# Altium schematic sheet PIPTIK.SchDoc: PIPTIK STM32F103
size A2; DrawnBy: Sklyar Roman; Organization: github.com/S-LABc/PIPTIK; Address1: Russian Federation; Address2: Sergiev Posad; DocumentNumber: 1; Revision: 1.1; SheetNumber: 1; SheetTotal: 1
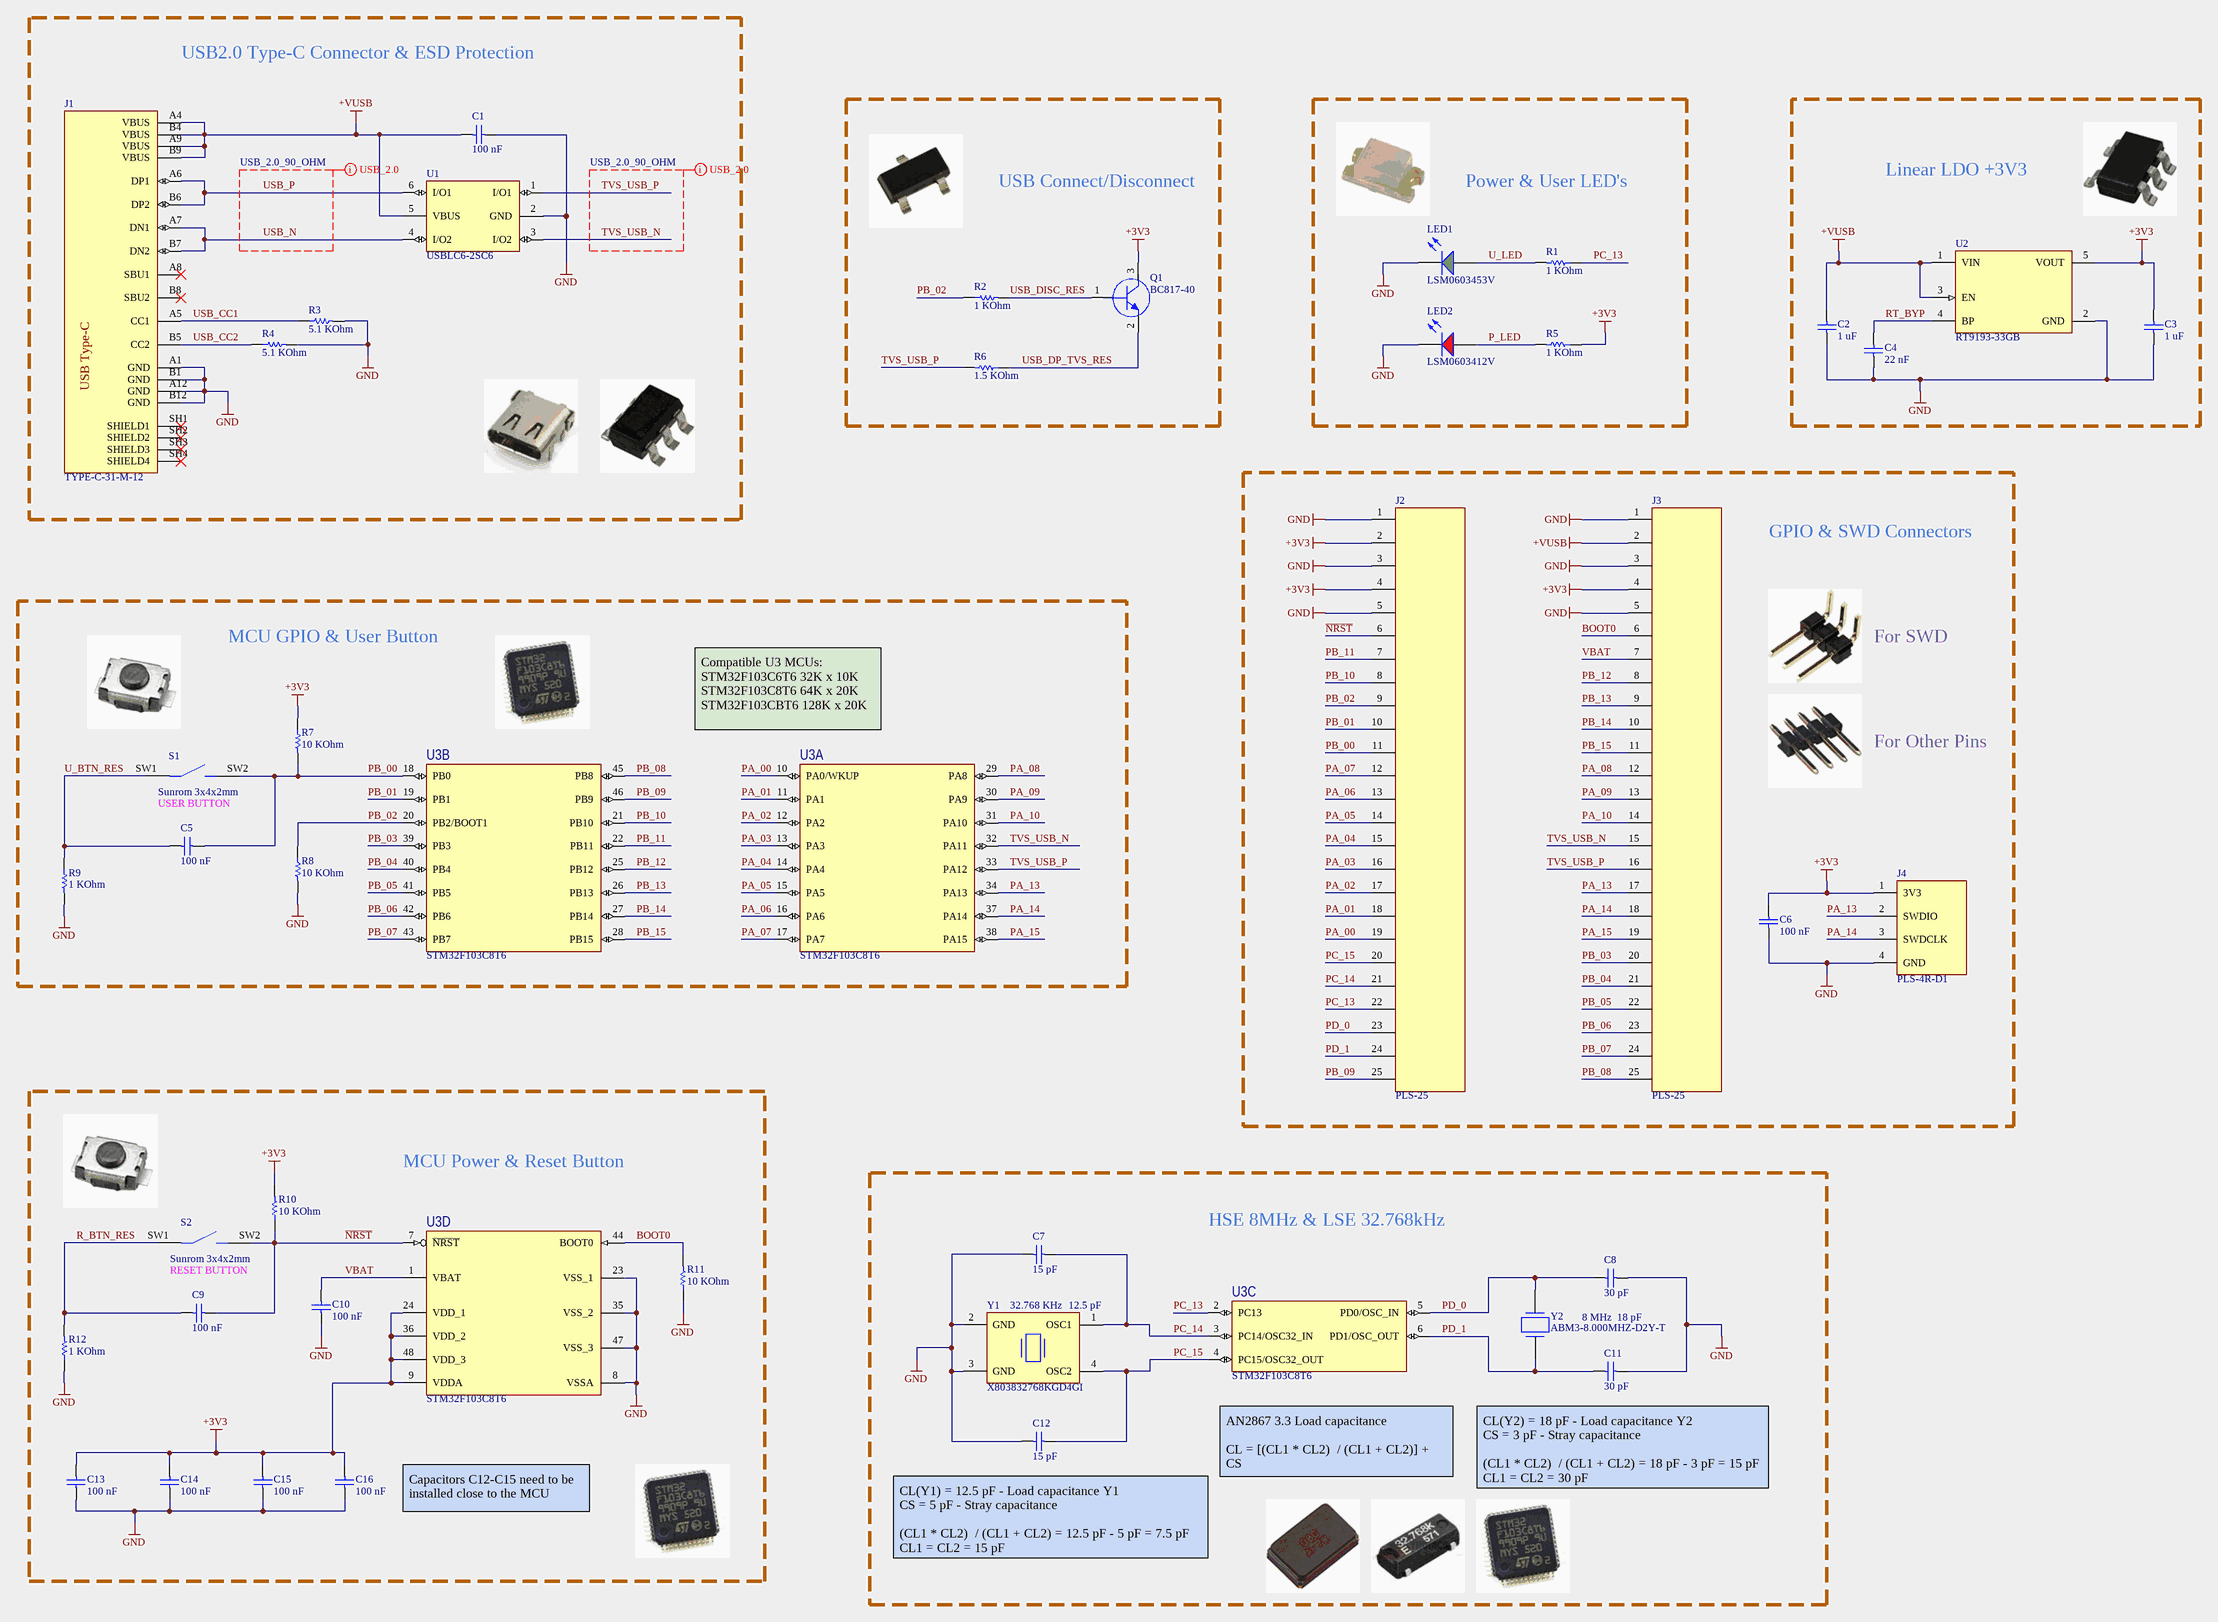
[diagram p0: PIPTIK.SchDoc]

## Parts
C1  Capacitance: 100 nF  [CAPC0603]  (hidden comment: CAP-100N)
C2  Capacitance: 1 uF  [CAPC0805]  (hidden comment: CAP-1U)
C3  Capacitance: 1 uF  [CAPC0805]  (hidden comment: CAP-1U)
C4  Capacitance: 22 nF  [CAPC0603]  (hidden comment: CAP-22N)
C5  Capacitance: 100 nF  [CAPC0603]  (hidden comment: CAP-100N)
C6  Capacitance: 100 nF  [CAPC0603]  (hidden comment: CAP-100N)
C7  Capacitance: 15 pF  [CAPC0603]  (hidden comment: CAP-15P)
C8  Capacitance: 30 pF  [CAPC0603]  (hidden comment: CAP-30P)
C9  Capacitance: 100 nF  [CAPC0603]  (hidden comment: CAP-100N)
C10  Capacitance: 100 nF  [CAPC0603]  (hidden comment: CAP-100N)
C11  Capacitance: 30 pF  [CAPC0603]  (hidden comment: CAP-30P)
C12  Capacitance: 15 pF  [CAPC0603]  (hidden comment: CAP-15P)
C13  Capacitance: 100 nF  [CAPC0603]  (hidden comment: CAP-100N)
C14  Capacitance: 100 nF  [CAPC0603]  (hidden comment: CAP-100N)
C15  Capacitance: 100 nF  [CAPC0603]  (hidden comment: CAP-100N)
C16  Capacitance: 100 nF  [CAPC0603]  (hidden comment: CAP-100N)
J1  TYPE-C-31-M-12  [TYPE-C-31-M-12]
J2  PLS-25  [PLS-25]
J3  PLS-25  [PLS-25]
J4  PLS-4RD  [PLS-4R-D1]  (value not drawn)
LED1  LSM0603453V  [LSM0603-Series]
LED2  LSM0603412V  [LSM0603-Series]
Q1  BC817-40  [SOT23-3-AnBon]
R1  Resistance: 1 KOhm  [RES0603]  (hidden comment: RES-1K)
R2  Resistance: 1 KOhm  [RES0603]  (hidden comment: RES-1K)
R3  Resistance: 5.1 KOhm  [RES0603]  (hidden comment: RES-5K1)
R4  Resistance: 5.1 KOhm  [RES0603]  (hidden comment: RES-5K1)
R5  Resistance: 1 KOhm  [RES0603]  (hidden comment: RES-1K)
R6  Resistance: 1.5 KOhm  [RES0603]  (hidden comment: RES-1K5)
R7  Resistance: 10 KOhm  [RES0603]  (hidden comment: RES-10K)
R8  Resistance: 10 KOhm  [RES0603]  (hidden comment: RES-10K)
R9  Resistance: 1 KOhm  [RES0603]  (hidden comment: RES-1K)
R10  Resistance: 10 KOhm  [RES0603]  (hidden comment: RES-10K)
R11  Resistance: 10 KOhm  [RES0603]  (hidden comment: RES-10K)
R12  Resistance: 1 KOhm  [RES0603]  (hidden comment: RES-1K)
S1  USER BUTTON  Model: Sunrom 3x4x2mm  [Tactile Switch SMD 3x4x2]
S2  RESET BUTTON  Model: Sunrom 3x4x2mm  [Tactile Switch SMD 3x4x2]
U1  USBLC6-2SC6  [SOT23-6L-STM]
U2  RT9193-33GB  [SOT-23-5-RICHTEK]
U3  STM32F103C8T6  [LQFP-48-STM32]  (parts A,B,C,D of 4)
Y1  Frequency: 32.768 KHz  LoadCapacitance: 12.5 pF  [YSX-306G-A]  (hidden comment: X803832768KGD4GI)
Y2  Frequency: 8 MHz  LoadCapacitance: 18 pF  [ABM3-2P]  (hidden comment: ABM3-8.000MHZ-D2Y-T)

## Blocks framed on the sheet
USB2.0 Type-C Connector & ESD Protection: C1 J1 R3 R4 U1
USB Connect/Disconnect: Q1 R2 R6
Power & User LED's: LED1 LED2 R1 R5
Linear LDO +3V3: C2-C4 U2
MCU GPIO & User Button: C5 R7-R9 S1 U3
MCU Power & Reset Button: C9 C10 C13-C16 R10-R12 S2 U3
HSE 8MHz & LSE 32.768kHz: C7 C8 C11 C12 U3 Y1 Y2

## Nets
+3V3: C3.2 C6.1 C13.2 C14.2 C15.2 C16.2 J2.2 J2.4 J3.4 J4.1(3V3) Q1.3(C) R5.1 R7.1 R10.2 U2.5(VOUT) U3.9(VDDA) U3.24(VDD_1) U3.36(VDD_2) U3.48(VDD_3)
+VUSB: C1.2 C2.2 J1.A4(VBUS) J1.A9(VBUS) J1.B4(VBUS) J1.B9(VBUS) J3.2 U1.5(VBUS) U2.1(VIN) U2.3(EN)
GND: C1.1 C2.1 C3.1 C4.1 C6.2 C7.1 C8.2 C10.1 C11.2 C12.1 C13.1 C14.1 C15.1 C16.1 J1.A1(GND) J1.A12(GND) J1.B1(GND) J1.B12(GND) J2.1 J2.3 J2.5 J3.1 J3.3 J3.5 J4.4(GND) LED1.1(K) LED2.1(K) R3.2 R4.2 R8.2 R9.2 R11.1 R12.1 U1.2(GND) U2.2(GND) U3.8(VSSA) U3.23(VSS_1) U3.35(VSS_2) U3.47(VSS_3) Y1.2(GND) Y1.3(GND)
BOOT0: J3.6 R11.2 U3.44(BOOT0)
~{NRST}: C9.1 J2.6 R10.1 S2.SW2 U3.7(~{NRST})
P_LED: LED2.2(A) R5.2
PA_00: J2.19 U3.10(PA0/WKUP)
PA_01: J2.18 U3.11(PA1)
PA_02: J2.17 U3.12(PA2)
PA_03: J2.16 U3.13(PA3)
PA_04: J2.15 U3.14(PA4)
PA_05: J2.14 U3.15(PA5)
PA_06: J2.13 U3.16(PA6)
PA_07: J2.12 U3.17(PA7)
PA_08: J3.12 U3.29(PA8)
PA_09: J3.13 U3.30(PA9)
PA_10: J3.14 U3.31(PA10)
PA_13: J3.17 J4.2(SWDIO) U3.34(PA13)
PA_14: J3.18 J4.3(SWDCLK) U3.37(PA14)
PA_15: J3.19 U3.38(PA15)
PB_00: C5.1 J2.11 R7.2 S1.SW2 U3.18(PB0)
PB_01: J2.10 U3.19(PB1)
PB_02: J2.9 R2.1 R8.1 U3.20(PB2/BOOT1)
PB_03: J3.20 U3.39(PB3)
PB_04: J3.21 U3.40(PB4)
PB_05: J3.22 U3.41(PB5)
PB_06: J3.23 U3.42(PB6)
PB_07: J3.24 U3.43(PB7)
PB_08: J3.25 U3.45(PB8)
PB_09: J2.25 U3.46(PB9)
PB_10: J2.8 U3.21(PB10)
PB_11: J2.7 U3.22(PB11)
PB_12: J3.8 U3.25(PB12)
PB_13: J3.9 U3.26(PB13)
PB_14: J3.10 U3.27(PB14)
PB_15: J3.11 U3.28(PB15)
PC_13: J2.22 R1.1 U3.2(PC13)
PC_14: C7.2 J2.21 U3.3(PC14/OSC32_IN) Y1.1(OSC1)
PC_15: C12.2 J2.20 U3.4(PC15/OSC32_OUT) Y1.4(OSC2)
PD_0: C8.1 J2.23 U3.5(PD0/OSC_IN) Y2.2(OSC2)
PD_1: C11.1 J2.24 U3.6(PD1/OSC_OUT) Y2.1(OSC1)
R_BTN_RES: C9.2 R12.2 S2.SW1
RT_BYP: C4.2 U2.4(BP)
TVS_USB_N: J3.15 U1.3(I/O2) U3.32(PA11)
TVS_USB_P: J3.16 R6.2 U1.1(I/O1) U3.33(PA12)
U_BTN_RES: C5.2 R9.1 S1.SW1
U_LED: LED1.2(A) R1.2
USB_CC1: J1.A5(CC1) R3.1
USB_CC2: J1.B5(CC2) R4.1
USB_DISC_RES: Q1.1(B) R2.2
USB_DP_TVS_RES: Q1.2(E) R6.1
USB_N: J1.A7(DN1) J1.B7(DN2) U1.4(I/O2)
USB_P: J1.A6(DP1) J1.B6(DP2) U1.6(I/O1)
VBAT: C10.2 J3.7 U3.1(VBAT)

Not connected (* = marked no-connect by the designer): J1 A8(SBU1)* B8(SBU2)* SH1(SHIELD1)* SH2(SHIELD2)* SH3(SHIELD3)* SH4(SHIELD4)*

## Layout directives
differential pair; net class USB2.0; differential pair class USB_2.0_90_OHM: TVS_USB_N, TVS_USB_P, USB_N, USB_P

## Notes on the sheet
- GPIO & SWD Connectors
- For SWD
- (near U3) Compatible U3 MCUs:
  STM32F103C6T6 32K x 10K
  STM32F103C8T6 64K x 20K
  STM32F103CBT6 128K x 20K
- For Other Pins
- (near U3) AN2867 3.3 Load capacitance
  CL = [(CL1 * CL2)  / (CL1 + CL2)] + CS
  (CL1 * CL2)  / (CL1 + CL2) = CL - CS
- Capacitors C12-C15 need to be installed close to the MCU
- (near C11) CL(Y2) = 18 pF - Load capacitance Y2
  CS = 3 pF - Stray capacitance
  (CL1 * CL2)  / (CL1 + CL2) = 18 pF - 3 pF = 15 pF
  CL1 = CL2 = 30 pF
- (near C12) CL(Y1) = 12.5 pF - Load capacitance Y1
  CS = 5 pF - Stray capacitance
  (CL1 * CL2)  / (CL1 + CL2) = 12.5 pF - 5 pF = 7.5 pF
  CL1 = CL2 = 15 pF
- Title
- Size:
- Date:
- File:
- A2
- Number:
- Time:
- Revision:
- Sheet
- of
- GitHub:
- github.com/S-LABc <http://github.com/S-LABc>
- (in symbol TYPE-C-31-M-12) USB Type-C

## Library data of the parts
C1 C5 C6 C9 C10 C13-C16 = CAP-100N: Chip Capacitor, 100 nF, +/- 5%; Voltage Rating: 50 V; Mount: Surface Mount; Tolerance: 5 %; Type: Capacitor
C2 C3 = CAP-1U: Chip Capacitor, 1 uF, +/- 5%; Voltage Rating: 50 V; Mount: Surface Mount; Tolerance: 5 %; Type: Capacitor
C4 = CAP-22N: Chip Capacitor, 22 nF, +/- 5%; Voltage Rating: 50 V; Mount: Surface Mount; Tolerance: 5 %; Type: Capacitor
C7 C12 = CAP-15P: Chip Capacitor, 15 pF, +/- 5%; Voltage Rating: 50 V; Mount: Surface Mount; Tolerance: 5 %; Type: Capacitor
C8 C11 = CAP-30P: Chip Capacitor, 30 pF, +/- 5%; Voltage Rating: 50 V; Mount: Surface Mount; Tolerance: 5 %; Type: Capacitor
J1 = TYPE-C-31-M-12: USB - Type C Female 16 8.94*7.3mm USB Connectors; Type: Connector; Mount: Surface Mount; PartNumber: TYPE-C-31-M-12
LED1 = LSM0603453V: Green LED 0603 3V 20mA; Mount: Surface Mount; Type: LED; Color: Green; PartNumber: LSM0603453V
LED2 = LSM0603412V: Red LED 0603 2V 20mA; Mount: Surface Mount; Type: LED; Color: Red; PartNumber: LSM0603412V
Q1 = BC817-40: NPN 500mA 45V 300mW SOT-23, hFE 250-600; Type: Transistor; Package: SOT23-3; Mount: Surface Mount; PartNumber: BC817-40
R1 R2 R5 R9 R12 = RES-1K: Chip Resistor, 1 KOhm, +/- 1%; Voltage Rating: 50 V; Mount: Surface Mount; Tolerance: 1 %; Type: Resistor
R3 R4 = RES-5K1: Chip Resistor, 5.1 KOhm, +/- 1%; Voltage Rating: 50 V; Mount: Surface Mount; Tolerance: 1 %; Type: Resistor
R6 = RES-1K5: Chip Resistor, 1.5 KOhm, +/- 1%; Voltage Rating: 50 V; Mount: Surface Mount; Tolerance: 1 %; Type: Resistor
R7 R8 R10 R11 = RES-10K: Chip Resistor, 10 KOhm, +/- 1%; Voltage Rating: 50 V; Mount: Surface Mount; Tolerance: 1 %; Type: Resistor
S1 S2 = Tactile Switch 3x4x2mm: SMD Tactile Switch, sunrom 3x4x2mm 2-Pin 12V DC 0.2A; Type: Tactile Switch Soft; Mount: Surface Mount
U1 = USBLC6-2SC6: Very low capacitance ESD protection  3.5 pF max; ESD: 25 kV; Mount: Surface Mount; Type: TVS Diode; PartNumber: USBLC6-2SC6
U2 = RT9193-33GB: Fixed 5.5V 3.3V 220mV @ 300mA SOT-23-5 Dropout Regulators(LDO); Type: LDO; Mount: Surface Mount; Package: SOT-23-5; PartNumber: RT9193-33GB
U3 = STM32F103C8T6: ARM based 32-bit MCU with 64 or 128 KB Flash; Digit: 32 bit; Type: Microcontroller; Mount: Surface Mount; PartNumber: STM32F103C8T6
Y1 = X803832768KGD4GI: 32.768KHz ±20ppm 12.5pF 50kΩ MC-306 SMD Crystal Resonators; Type: Quartz Crystal Resonator; Mount: Surface Mount; PartNumber: X803832768KGD4GI
Y2 = ABM3-8.000MHZ-D2Y-T: 8MHz ±20ppm 18pF 140 Ohm SMD Crystal Resonators; Type: Quartz Crystal Resonator; Mount: Surface Mount; PartNumber: ABM3-8.000MHZ-D2Y-T
J2 J3 = PLS-25: Type: Connector; Mount: Through Hole; PartNumber: PLS-25
J4 = PLS-4RD: Type: Connector; Mount: Through Hole; PartNumber: PLS-4R-D1